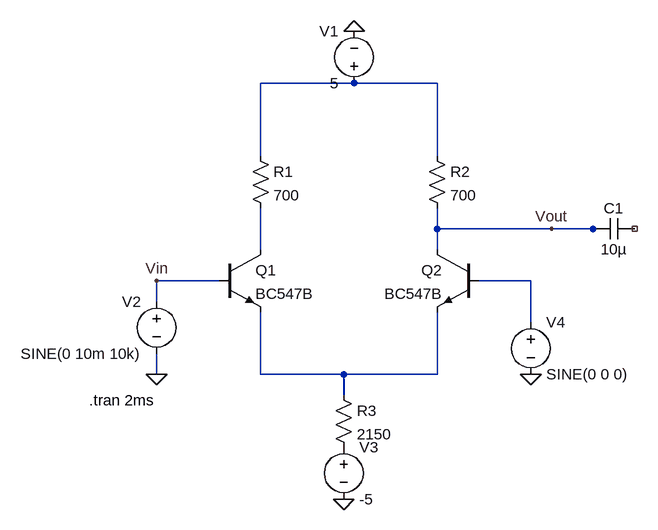
[diagram p0: schematic pre_amplifier.asc]
pre_amplifier.asc, the LTspice schematic file:
Version 4
SHEET 1 984 680
WIRE 384 -128 240 -128
WIRE 512 -128 384 -128
WIRE 240 -16 240 -128
WIRE 512 -16 512 -128
WIRE 512 96 512 64
WIRE 688 96 512 96
WIRE 752 96 688 96
WIRE 768 96 752 96
WIRE 240 128 240 64
WIRE 512 128 512 96
WIRE 176 176 80 176
WIRE 656 176 576 176
WIRE 80 208 80 176
WIRE 656 240 656 176
WIRE 80 320 80 288
WIRE 240 320 240 224
WIRE 368 320 240 320
WIRE 512 320 512 224
WIRE 512 320 368 320
WIRE 368 352 368 320
FLAG 80 320 0
FLAG 384 -208 0
FLAG 368 512 0
FLAG 656 320 0
FLAG 80 176 Vin
FLAG 688 96 Vout
SYMBOL npn 176 128 R0
SYMATTR InstName Q1
SYMATTR Value BC547B
SYMBOL res 224 -32 R0
SYMATTR InstName R1
SYMATTR Value 700
SYMBOL res 496 -32 R0
SYMATTR InstName R2
SYMATTR Value 700
SYMBOL npn 576 128 M0
SYMATTR InstName Q2
SYMATTR Value BC547B
SYMBOL res 352 336 R0
SYMATTR InstName R3
SYMATTR Value 2150
SYMBOL voltage 384 -112 R180
WINDOW 0 24 96 Left 2
WINDOW 3 24 16 Left 2
WINDOW 123 0 0 Left 0
WINDOW 39 0 0 Left 0
SYMATTR InstName V1
SYMATTR Value 5
SYMBOL voltage 80 192 M0
WINDOW 123 24 124 Left 2
WINDOW 39 0 0 Left 0
SYMATTR InstName V2
SYMATTR Value SINE(0 10m 10k)
SYMBOL voltage 368 416 R0
WINDOW 123 0 0 Left 0
WINDOW 39 0 0 Left 0
SYMATTR InstName V3
SYMATTR Value -5
SYMBOL cap 752 112 R270
WINDOW 0 32 32 VTop 2
WINDOW 3 0 32 VBottom 2
SYMATTR InstName C1
SYMATTR Value 10µ
SYMBOL voltage 656 224 R0
WINDOW 123 24 124 Left 2
WINDOW 39 0 0 Left 0
SYMATTR InstName V4
SYMATTR Value SINE(0 0 0)
TEXT -24 360 Left 2 !.tran 2ms

The netlist it stands for:
* pre_amplifier.asc
Q1 N002 Vin N004 0 BC547B
R1 N001 N002 700
R2 N001 Vout 700
Q2 Vout N003 N004 0 BC547B
R3 N004 P001 2150
V1 N001 0 5
V2 Vin 0 SINE(0 10m 10k)
V3 P001 0 -5
C1 Vout NC_01 10µ
V4 N003 0 SINE(0 0 0)
.model NPN NPN
.model PNP PNP
.lib standard.bjt
.tran 2ms
.backanno
.end